# EAGLE schematic ATtinyBoard_3 (EAGLE 6.4)
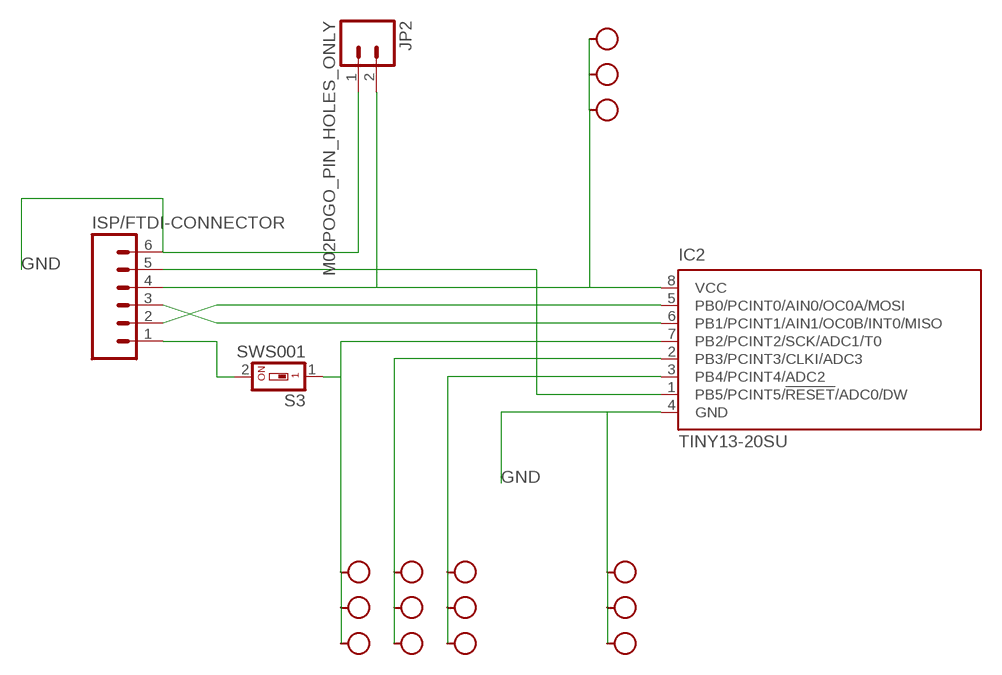
[diagram p0: schematic, sheet 1]

## Parts
H1  SEW_HOLE-SMALL  [SIMPLE_HOLE_SM]
H2  SEW_HOLE-SMALL  [SIMPLE_HOLE_SM]
H3  SEW_HOLE-SMALL  [SIMPLE_HOLE_SM]
H4  SEW_HOLE-SMALL  [SIMPLE_HOLE_SM]
H5  SEW_HOLE-SMALL  [SIMPLE_HOLE_SM]
H6  SEW_HOLE-SMALL  [SIMPLE_HOLE_SM]
H7  SEW_HOLE-SMALL  [SIMPLE_HOLE_SM]
H8  SEW_HOLE-SMALL  [SIMPLE_HOLE_SM]
H9  SEW_HOLE-SMALL  [SIMPLE_HOLE_SM]
H10  SEW_HOLE-SMALL  [SIMPLE_HOLE_SM]
H11  SEW_HOLE-SMALL  [SIMPLE_HOLE_SM]
H12  SEW_HOLE-SMALL  [SIMPLE_HOLE_SM]
H13  SEW_HOLE-SMALL  [SIMPLE_HOLE_SM]
H14  SEW_HOLE-SMALL  [SIMPLE_HOLE_SM]
H15  SEW_HOLE-SMALL  [SIMPLE_HOLE_SM]
IC2  TINY13-20SU  [8S2]
ISP/FTDI-CONNECTOR  M06SMD  [1X06-SMD]
JP2  M02POGO_PIN_HOLES_ONLY  [1X02_PP_HOLES_ONLY]
S3  SWS001  [SMS-001]

## Nets
GND: H4.P$1 H14.P$1 H15.P$1 IC2.4(GND) ISP/FTDI-CONNECTOR.6 JP2.1
N$1: IC2.5(PB0/PCINT0/AIN0/OC0A/MOSI) ISP/FTDI-CONNECTOR.2
N$2: H3.P$1 H8.P$1 H9.P$1 IC2.3(PB4/PCINT4/ADC2)
N$3: IC2.1(PB5/PCINT5/!RESET!/ADC0/DW) ISP/FTDI-CONNECTOR.5
N$4: IC2.6(PB1/PCINT1/AIN1/OC0B/INT0/MISO) ISP/FTDI-CONNECTOR.3
N$5: ISP/FTDI-CONNECTOR.1 S3.2
N$6: H2.P$1 H10.P$1 H11.P$1 IC2.2(PB3/PCINT3/CLKI/ADC3)
N$7: H5.P$1 H6.P$1 H7.P$1 IC2.8(VCC) ISP/FTDI-CONNECTOR.4 JP2.2
N$8: H1.P$1 H12.P$1 H13.P$1 IC2.7(PB2/PCINT2/SCK/ADC1/T0) S3.1

## Library data of the parts
H1-H15 = LilyPad-Wearables:SEW_HOLE-SMALL: .070" hole with 20mil annular ring
IC2 = atmel:TINY13: 8-bit AVR Microcontroller with 1K Bytes In-System Programmable Flash Source: http://www.atmel.com/dyn/resources/prod_documents/2535S.pdf; MPN: ATTINY13-20SU; OC_FARNELL: 9171568; OC_NEWARK: 96K6522
ISP/FTDI-CONNECTOR = SparkFun-Connectors:M06: Header 6 Standard 6-pin 0.1" header. Use with straight break away headers (SKU : PRT-00116), right angle break away headers (PRT-00553), swiss pins (PRT-00743), machine pins (PRT-00117), and female headers (PRT-00115). Molex polarized connector foot print use with SKU : PRT-08094 with associated crimp pins and housings. NOTES ON THE VARIANTS LOCK and LOCK_LONGPADS... This footprint was designed to help hold the alignment of a through-hole component (i.e. 6-pin header) while soldering it into place. You may notice that each hole has been shifted either up or down by 0.005 of an inch from it's more standard position (which is a perfectly straight line). This slight alteration caused the pins (the squares in the middle) to touch the edges of the holes. Because they are alternating, it causes a "brace" to hold the component in place. 0.005 has proven to be the perfect amount of "off-center" position when using our standard breakaway headers. Although looks a little odd when you look at the bare footprint, once you have a header in there, the alteration is very hard to notice. Also,if you push a header all the way into place, it is covered up entirely on the bottom side. This idea of altering the position of holes to aid alignment will be further integrated into the Sparkfun Library for other footprints. It can help hold any component with 3 or more connection pins.
JP2 = SparkFun-Connectors:M02: Standard 2-pin 0.1" header. Use with - straight break away headers ( PRT-00116) - right angle break away headers (PRT-00553) - swiss pins (PRT-00743) - machine pins (PRT-00117) - female headers (PRT-00115) Molex polarized connector foot print use with: PRT-08233 with associated crimp pins and housings. 2.54_SCREWTERM for use with PRT-10571. 3.5mm Screw Terminal footprints for PRT-08084 5mm Screw Terminal footprints for use with PRT-08433
S3 = smd-special:SWS001: SMD Dip Switch 1 pol.